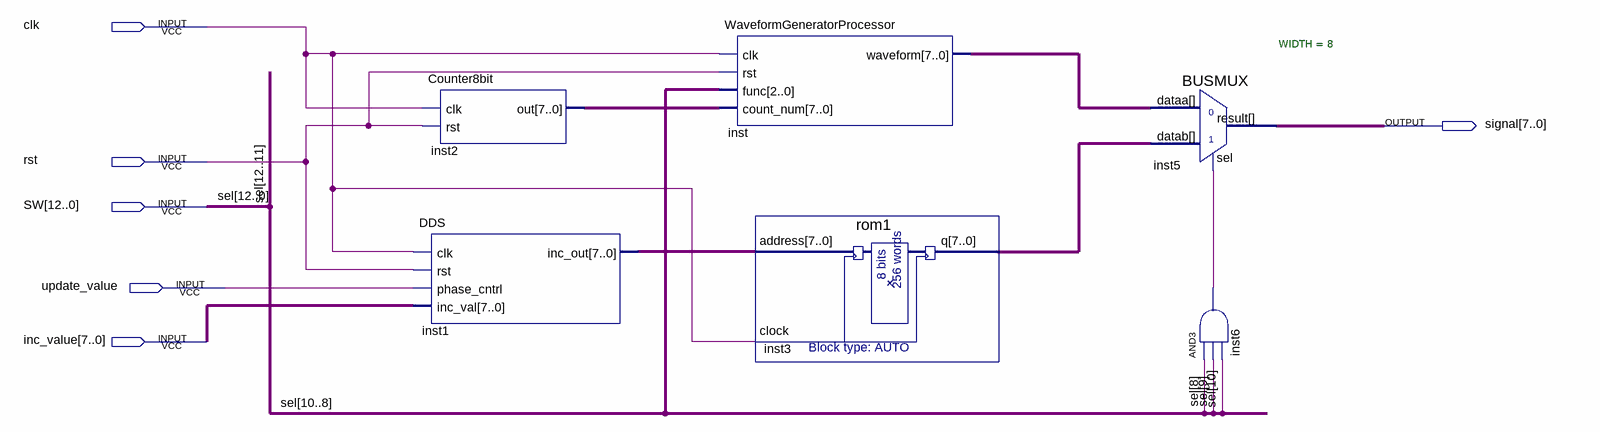
[diagram p0: schematic sheet]
// Quartus schematic WaveformGenerator.bdf as structural Verilog: 6 symbols, 6 pins
module WaveformGenerator (
  input  clk,
  input  rst,
  input  [12:0] SW,
  input  update_value,
  input  [7:0] inc_value,
  output [7:0] signal
);

  wire inst6_out;
  wire [7:0] inst1_inc_out, inst2_out, inst3_q, inst_waveform;

  Counter8bit inst2 (.clk(clk), .rst(rst), .out(inst2_out));
  DDS inst1 (.clk(clk), .rst(rst), .phase_cntrl(update_value), .inc_val(inc_value), .inc_out(inst1_inc_out));
  WaveformGeneratorProcessor inst (.clk(clk), .rst(rst), .func(SW), .count_num(inst2_out), .waveform(inst_waveform));
  rom1 inst3 (.address(inst1_inc_out), .clock(clk), .q(inst3_q));
  BUSMUX #(.WIDTH(8)) inst5 (.datab(inst3_q), .sel(inst6_out), .dataa(inst_waveform), .result(signal));
  and inst6 (inst6_out, SW[8], SW[9], SW[10]);

  // Other names for the same wires on the sheet: sel[12:0] = SW
endmodule
